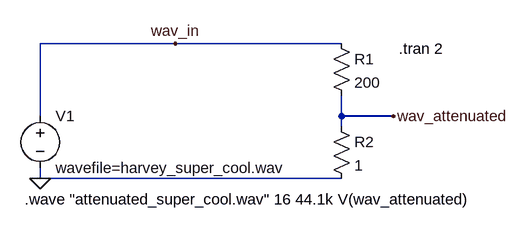
[diagram p0: schematic part_1_ab.asc]
part_1_ab.asc, the LTspice schematic file:
Version 4
SHEET 1 944 680
WIRE 400 -48 192 -48
WIRE 656 -48 400 -48
WIRE 192 64 192 -48
WIRE 656 64 656 32
WIRE 736 64 656 64
WIRE 656 80 656 64
WIRE 192 160 192 144
WIRE 656 160 192 160
FLAG 400 -48 wav_in
FLAG 736 64 wav_attenuated
FLAG 192 160 0
SYMBOL voltage 192 48 R0
SYMATTR InstName V1
SYMATTR Value wavefile=harvey_super_cool.wav
SYMBOL res 640 -64 R0
SYMATTR InstName R1
SYMATTR Value 200
SYMBOL res 640 64 R0
SYMATTR InstName R2
SYMATTR Value 1
TEXT 168 192 Left 2 !.wave "attenuated_super_cool.wav" 16 44.1k V(wav_attenuated)
TEXT 744 -40 Left 2 !.tran 2

The netlist it stands for:
* part_1_ab.asc
V1 wav_in 0 wavefile=harvey_super_cool.wav
R1 wav_in wav_attenuated 200
R2 wav_attenuated 0 1
.wave "attenuated_super_cool.wav" 16 44.1k V(wav_attenuated)
.tran 2
.backanno
.end